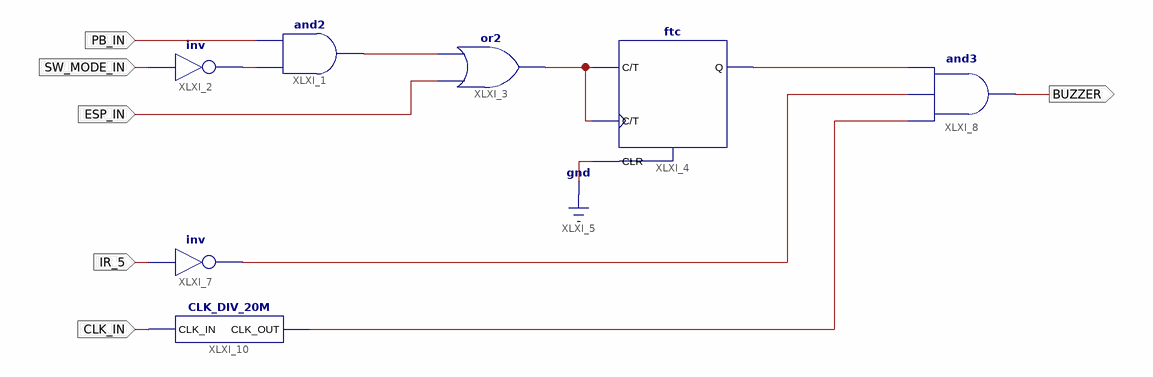
[diagram p0: schematic sheet 1]
// Xilinx ISE schematic Alarm_Garage_V2.sch (spartan6) as structural Verilog: 7 symbols, 6 ports
module Alarm_Garage_V2 (
  input  PB_IN,
  input  SW_MODE_IN,
  input  ESP_IN,
  input  IR_5,
  input  CLK_IN,
  output BUZZER
);

  wire XLXN_1, XLXN_4, XLXN_6, XLXN_9, XLXN_18, XLXN_22;

  and XLXI_1 (XLXN_4, XLXN_1, PB_IN);
  not XLXI_2 (XLXN_1, SW_MODE_IN);
  or XLXI_3 (XLXN_6, ESP_IN, XLXN_4);
  ftc XLXI_4 (.C(XLXN_6), .CLR(1'b0), .T(XLXN_6), .Q(XLXN_18));
  and XLXI_8 (BUZZER, XLXN_22, XLXN_9, XLXN_18);
  not XLXI_7 (XLXN_9, IR_5);
  CLK_DIV_20M XLXI_10 (.CLK_IN(CLK_IN), .CLK_OUT(XLXN_22));
endmodule
